# Altium schematic sheet CPU.SchDoc
size 420 x 297 mm; Organization: Develer s.r.l.; Address1: via Mugellese 1/A; Address2: 50019 Campi Bisenzio; Address3: Firenze; Address4: ITALY; Revision: A; SheetNumber: 1; SheetTotal: 1
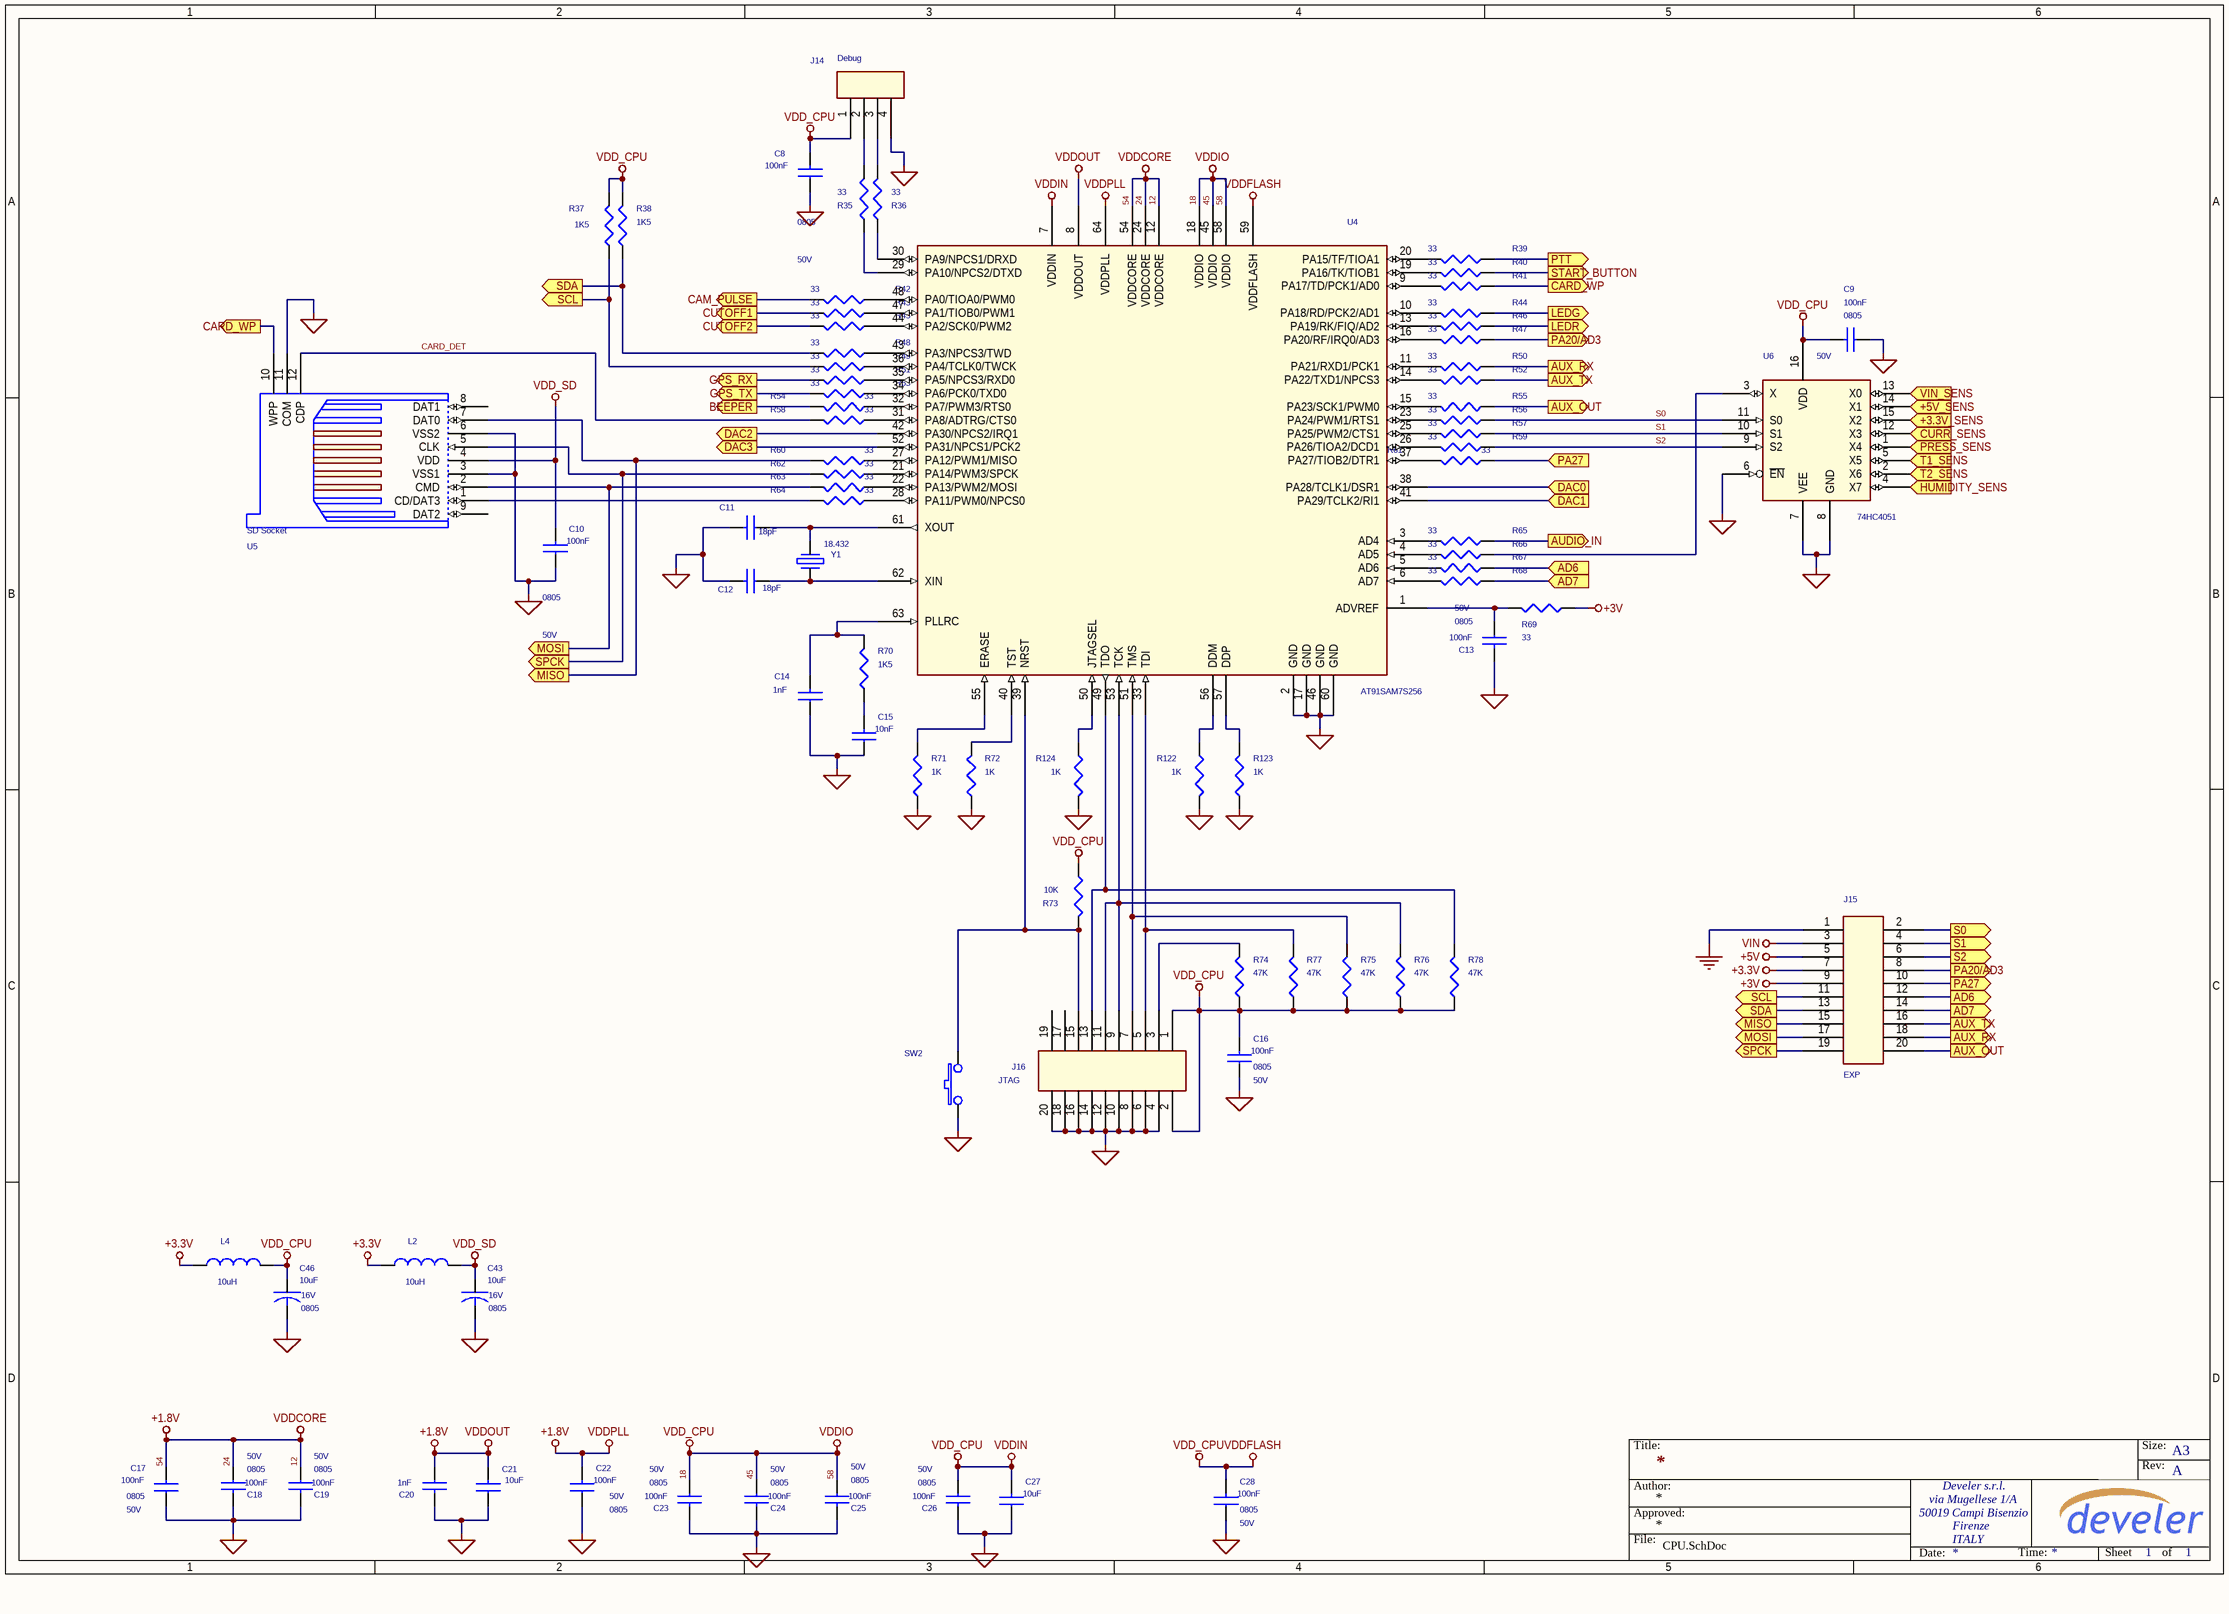
[diagram p0: CPU.SchDoc]

## Parts
C8  100nF  case: 0805  voltage: 50V  [SM/C_0805]
C9  100nF  case: 0805  voltage: 50V  [SM/C_0805]
C10  100nF  case: 0805  voltage: 50V  [SM/C_0805]
C11  18pF  [SM/C_0805]
C12  18pF  [SM/C_0805]
C13  100nF  voltage: 50V  case: 0805  [SM/C_0805]
C14  1nF  [SM/C_0805]
C15  10nF  [SM/C_0805]
C16  100nF  voltage: 50V  case: 0805  [SM/C_0805]
C17  100nF  voltage: 50V  case: 0805  [SM/C_0805]
C18  100nF  case: 0805  voltage: 50V  [SM/C_0805]
C19  100nF  case: 0805  voltage: 50V  [SM/C_0805]
C20  1nF  [SM/C_0805]
C21  10uF  [SM/C_0805]
C22  100nF  case: 0805  voltage: 50V  [SM/C_0805]
C23  100nF  voltage: 50V  case: 0805  [SM/C_0805]
C24  100nF  case: 0805  voltage: 50V  [SM/C_0805]
C25  100nF  case: 0805  voltage: 50V  [SM/C_0805]
C26  100nF  case: 0805  voltage: 50V  [SM/C_0805]
C27  10uF  [SM/C_0805]
C28  100nF  voltage: 50V  case: 0805  [SM/C_0805]
C43  10uF  case: 0805  voltage: 16V  [SM/C_0805]
C46  10uF  case: 0805  voltage: 16V  [SM/C_0805]
J14  Debug  [BLKCON.100/VH/TM1SQ/W.100/4]
J15  EXP  [BLKCON.100/VH/TM2OE/W.200/20]
J16  JTAG  [BLKCON.100/VH/TM2OE/W.200/20]
L2  10uH  [SM/L_1210]
L4  10uH  [SM/L_1210]
R35  33  [SM/R_0805]
R36  33  [SM/R_0805]
R37  1K5  [SM/R_0805]
R38  1K5  [SM/R_0805]
R39  33  [SM/R_0805]
R40  33  [SM/R_0805]
R41  33  [SM/R_0805]
R42  33  [SM/R_0805]
R43  33  [SM/R_0805]
R44  33  [SM/R_0805]
R45  33  [SM/R_0805]
R46  33  [SM/R_0805]
R47  33  [SM/R_0805]
R48  33  [SM/R_0805]
R49  33  [SM/R_0805]
R50  33  [SM/R_0805]
R51  33  [SM/R_0805]
R52  33  [SM/R_0805]
R53  33  [SM/R_0805]
R54  33  [SM/R_0805]
R55  33  [SM/R_0805]
R56  33  [SM/R_0805]
R57  33  [SM/R_0805]
R58  33  [SM/R_0805]
R59  33  [SM/R_0805]
R60  33  [SM/R_0805]
R61  33  [SM/R_0805]
R62  33  [SM/R_0805]
R63  33  [SM/R_0805]
R64  33  [SM/R_0805]
R65  33  [SM/R_0805]
R66  33  [SM/R_0805]
R67  33  [SM/R_0805]
R68  33  [SM/R_0805]
R69  33  [SM/R_0805]
R70  1K5  [SM/R_0805]
R71  1K  [SM/R_0805]
R72  1K  [SM/R_0805]
R73  10K  [SM/R_0805]
R74  47K  [SM/R_0805]
R75  47K  [SM/R_0805]
R76  47K  [SM/R_0805]
R77  47K  [SM/R_0805]
R78  47K  [SM/R_0805]
R122  1K  [SM/R_0805]
R123  1K  [SM/R_0805]
R124  1K  [SM/R_0805]
SW2  RESET  [SWITCH/KSJ]  (value not drawn)
U4  AT91SAM7S256  [QUAD.50M/64/WG12.00]
U5  SD Socket  [CARD_SOCKET]
U6  74HC4051  [SOG.050/16/WG.244/L.375]
Y1  18.432  [CRYSTAL/HC49UP]

## Ports
+3.3V_SENS (out), +5V_SENS (out), AD6 (in), AD6 (out), AD7 (in), AD7 (out), AUDIO_IN (out), AUX_OUT (out), AUX_RX (out), AUX_TX (out), BEEPER (out), CAM_PULSE (out), CARD_WP (out), CURR_SENS (out), CUTOFF1 (out), CUTOFF2 (out), DAC0 (in), DAC1 (in), DAC2 (out), DAC3 (out), GPS_RX (out), GPS_TX (out), HUMIDITY_SENS (out), LEDG (out), LEDR (out), MISO (out), MOSI (out), PA20/AD3 (out), PA27 (in), PA27 (out), PRESS_SENS (out), PTT (out), S0 (out), S1 (out), S2 (out), SCL (out), SDA (out), SPCK (out), START_BUTTON (out), T1_SENS (out), T2_SENS (out), VIN_SENS (out)

## Nets
12: C17.2 C18.1 C19.1 C20.1 C21.2 C22.2 U4.8(VDDOUT) U4.12(VDDCORE) U4.24(VDDCORE) U4.54(VDDCORE) U4.64(VDDPLL)  [also labelled +1.8V, 24, 54, VDDCORE, VDDOUT, VDDPLL]
18: C8.2 C9.2 C16.2 C23.1 C24.1 C25.1 C26.1 C27.2 C28.2 C46.1 J14.1 J16.1 J16.2 L4.1 R37.1 R38.1 R73.1 R74.1 R75.1 R76.1 R77.1 R78.1 U4.7(VDDIN) U4.18(VDDIO) U4.45(VDDIO) U4.58(VDDIO) U4.59(VDDFLASH) U6.16(VDD)  [also labelled 45, 58, VDD_CPU, VDDFLASH, VDDIN, VDDIO]
+3.3V: J15.7 L2.2 L4.2
+3V: J15.9 R69.2
+5V: J15.5
GND: J15.1
GND_DIGITAL: C8.1 C9.1 C10.1 C11.2 C12.2 C13.2 C14.1 C15.1 C16.1 C17.1 C18.2 C19.2 C20.2 C21.1 C22.1 C23.2 C24.2 C25.2 C26.2 C27.1 C28.1 C43.2 C46.2 J14.4 J16.4 J16.6 J16.8 J16.10 J16.12 J16.14 J16.16 J16.18 J16.20 R71.1 R72.1 R122.1 R123.1 R124.1 SW2.1 U4.2(GND) U4.17(GND) U4.46(GND) U4.60(GND) U5.3(VSS1) U5.6(VSS2) U5.11(COM) U6.6(~{EN}) U6.7(VEE) U6.8(GND)
VDD_SD: C10.2 C43.1 L2.1 U5.4(VDD)
VIN: J15.3
+3.3V_SENS: U6.15(X2) ; port +3.3V_SENS
+5V_SENS: U6.14(X1) ; port +5V_SENS
AD6: J15.12 R67.2 ; port AD6
AD7: J15.14 R68.2 ; port AD7
AUDIO_IN: R65.2 ; port AUDIO_IN
AUX_OUT: J15.20 R55.2 ; port AUX_OUT
AUX_RX: J15.18 R50.2 ; port AUX_RX
AUX_TX: J15.16 R52.2 ; port AUX_TX
BEEPER: R54.2 ; port BEEPER
CAM_PULSE: R42.1 ; port CAM_PULSE
CARD_DET: R58.2 U5.12(CDP)
CARD_WP: R41.2 U5.10(WPP) ; port CARD_WP
CURR_SENS: U6.12(X3) ; port CURR_SENS
CUTOFF1: R43.1 ; port CUTOFF1
CUTOFF2: R45.1 ; port CUTOFF2
DAC0: U4.38(PA28/TCLK1/DSR1) ; port DAC0
DAC1: U4.41(PA29/TCLK2/RI1) ; port DAC1
DAC2: U4.42(PA30/NPCS2/IRQ1) ; port DAC2
DAC3: U4.52(PA31/NPCS1/PCK2) ; port DAC3
GPS_RX: R51.1 ; port GPS_RX
GPS_TX: R53.1 ; port GPS_TX
HUMIDITY_SENS: U6.4(X7) ; port HUMIDITY_SENS
LEDG: R44.2 ; port LEDG
LEDR: R46.2 ; port LEDR
MISO: J15.15 R60.2 U5.7(DAT0) ; port MISO
MOSI: J15.17 R63.2 U5.2(CMD) ; port MOSI
PA20/AD3: J15.8 R47.2 ; port PA20/AD3
PA27: J15.10 R61.1 ; port PA27
PRESS_SENS: U6.1(X4) ; port PRESS_SENS
PTT: R39.2 ; port PTT
S0: R56.2 U6.11(S0)
S0: J15.2 ; port S0  [a separate net that carries the same name]
S1: R57.2 U6.10(S1)
S1: J15.4 ; port S1  [a separate net that carries the same name]
S2: R59.2 U6.9(S2)
S2: J15.6 ; port S2  [a separate net that carries the same name]
SCL: J15.11 R37.2 R49.1 ; port SCL
SDA: J15.13 R38.2 R48.1 ; port SDA
SPCK: J15.19 R62.2 U5.5(CLK) ; port SPCK
START_BUTTON: R40.2 ; port START_BUTTON
T1_SENS: U6.5(X5) ; port T1_SENS
T2_SENS: U6.2(X6) ; port T2_SENS
VIN_SENS: U6.13(X0) ; port VIN_SENS
NetC11_1: C11.1 U4.61(XOUT) Y1.1
NetC12_1: C12.1 U4.62(XIN) Y1.2
NetC13_1: C13.1 R69.1 U4.1(ADVREF)
NetC14_2: C14.2 R70.2 U4.63(PLLRC)
NetC15_2: C15.2 R70.1
NetJ14_2: J14.2 R35.2
NetJ14_3: J14.3 R36.2
NetJ16_3: J16.3 R74.2
NetJ16_5: J16.5 R77.2 U4.33(TDI)
NetJ16_7: J16.7 R75.2 U4.51(TMS)
NetJ16_9: J16.9 J16.11 R76.2 U4.53(TCK)
NetJ16_13: J16.13 R78.2 U4.49(TDO)
NetJ16_15: J16.15 R73.2 SW2.2 U4.39(NRST)
NetR35_1: R35.1 U4.29(PA10/NPCS2/DTXD)
NetR36_1: R36.1 U4.30(PA9/NPCS1/DRXD)
NetR39_1: R39.1 U4.20(PA15/TF/TIOA1)
NetR40_1: R40.1 U4.19(PA16/TK/TIOB1)
NetR41_1: R41.1 U4.9(PA17/TD/PCK1/AD0)
NetR42_2: R42.2 U4.48(PA0/TIOA0/PWM0)
NetR43_2: R43.2 U4.47(PA1/TIOB0/PWM1)
NetR44_1: R44.1 U4.10(PA18/RD/PCK2/AD1)
NetR45_2: R45.2 U4.44(PA2/SCK0/PWM2)
NetR46_1: R46.1 U4.13(PA19/RK/FIQ/AD2)
NetR47_1: R47.1 U4.16(PA20/RF/IRQ0/AD3)
NetR48_2: R48.2 U4.43(PA3/NPCS3/TWD)
NetR49_2: R49.2 U4.36(PA4/TCLK0/TWCK)
NetR50_1: R50.1 U4.11(PA21/RXD1/PCK1)
NetR51_2: R51.2 U4.35(PA5/NPCS3/RXD0)
NetR52_1: R52.1 U4.14(PA22/TXD1/NPCS3)
NetR53_2: R53.2 U4.34(PA6/PCK0/TXD0)
NetR54_1: R54.1 U4.32(PA7/PWM3/RTS0)
NetR55_1: R55.1 U4.15(PA23/SCK1/PWM0)
NetR56_1: R56.1 U4.23(PA24/PWM1/RTS1)
NetR57_1: R57.1 U4.25(PA25/PWM2/CTS1)
NetR58_1: R58.1 U4.31(PA8/ADTRG/CTS0)
NetR59_1: R59.1 U4.26(PA26/TIOA2/DCD1)
NetR60_1: R60.1 U4.27(PA12/PWM1/MISO)
NetR61_2: R61.2 U4.37(PA27/TIOB2/DTR1)
NetR62_1: R62.1 U4.21(PA14/PWM3/SPCK)
NetR63_1: R63.1 U4.22(PA13/PWM2/MOSI)
NetR64_1: R64.1 U4.28(PA11/PWM0/NPCS0)
NetR64_2: R64.2 U5.1(CD/DAT3)
NetR65_1: R65.1 U4.3(AD4)
NetR66_1: R66.1 U4.4(AD5)
NetR66_2: R66.2 U6.3(X)
NetR67_1: R67.1 U4.5(AD6)
NetR68_1: R68.1 U4.6(AD7)
NetR71_2: R71.2 U4.55(ERASE)
NetR72_2: R72.2 U4.40(TST)
NetR122_2: R122.2 U4.56(DDM)
NetR123_2: R123.2 U4.57(DDP)
NetR124_2: R124.2 U4.50(JTAGSEL)

Not connected (* = marked no-connect by the designer): J16 17 19; U5 8(DAT1) 9(DAT2)

## Notes on the sheet
- Title:
- Size:
- Rev:
- A3
- Author:
- Approved:
- File:
- Date:
- Time:
- Sheet
- of

## Library data of the parts
C8-C10 C13 C16-C19 C22-C26 C28 = CAP NP: COMPGROUP: 2
C11 C12 C14 C15 = CAP NP: voltage: 16V; COMPGROUP: 2; case: 0805
C20 C21 C27 = CAP NP: COMPGROUP: 2; voltage: 16V; case: 0805
C43 C46 = C: COMPGROUP: 3
J14 = CON4: COMPGROUP: 2; case: THD
J15 J16 = CON20A: COMPGROUP: 2; case: THD
L2 L4 = INDUCTOR: COMPGROUP: 3; case: 1210
R35 R36 R38 R39 R41-R43 R45 R48 R49 R52 R53 R60-R64 R69 R71-R78 R122-R124 = R: 1st: 5%; COMPGROUP: 2; case: 0805
R37 R40 R44 R46 R47 R50 R51 R54-R59 R65-R68 R70 = R: COMPGROUP: 2; 1st: 5%; case: 0805
SW2 = SW_PB_SPST: COMPGROUP: 2; case: THD
U4 = AT91SAM7S 64pin_0: COMPGROUP: 2; case: LQFP
U5 = Card Socket_1: COMPGROUP: 2; case: SMD
U6 = 74HC4051: COMPGROUP: 2; case: soic
Y1 = QUARZO: COMPGROUP: 2; case: HP49